# Altium schematic sheet BTTC测试控制板.SchDoc
size A3
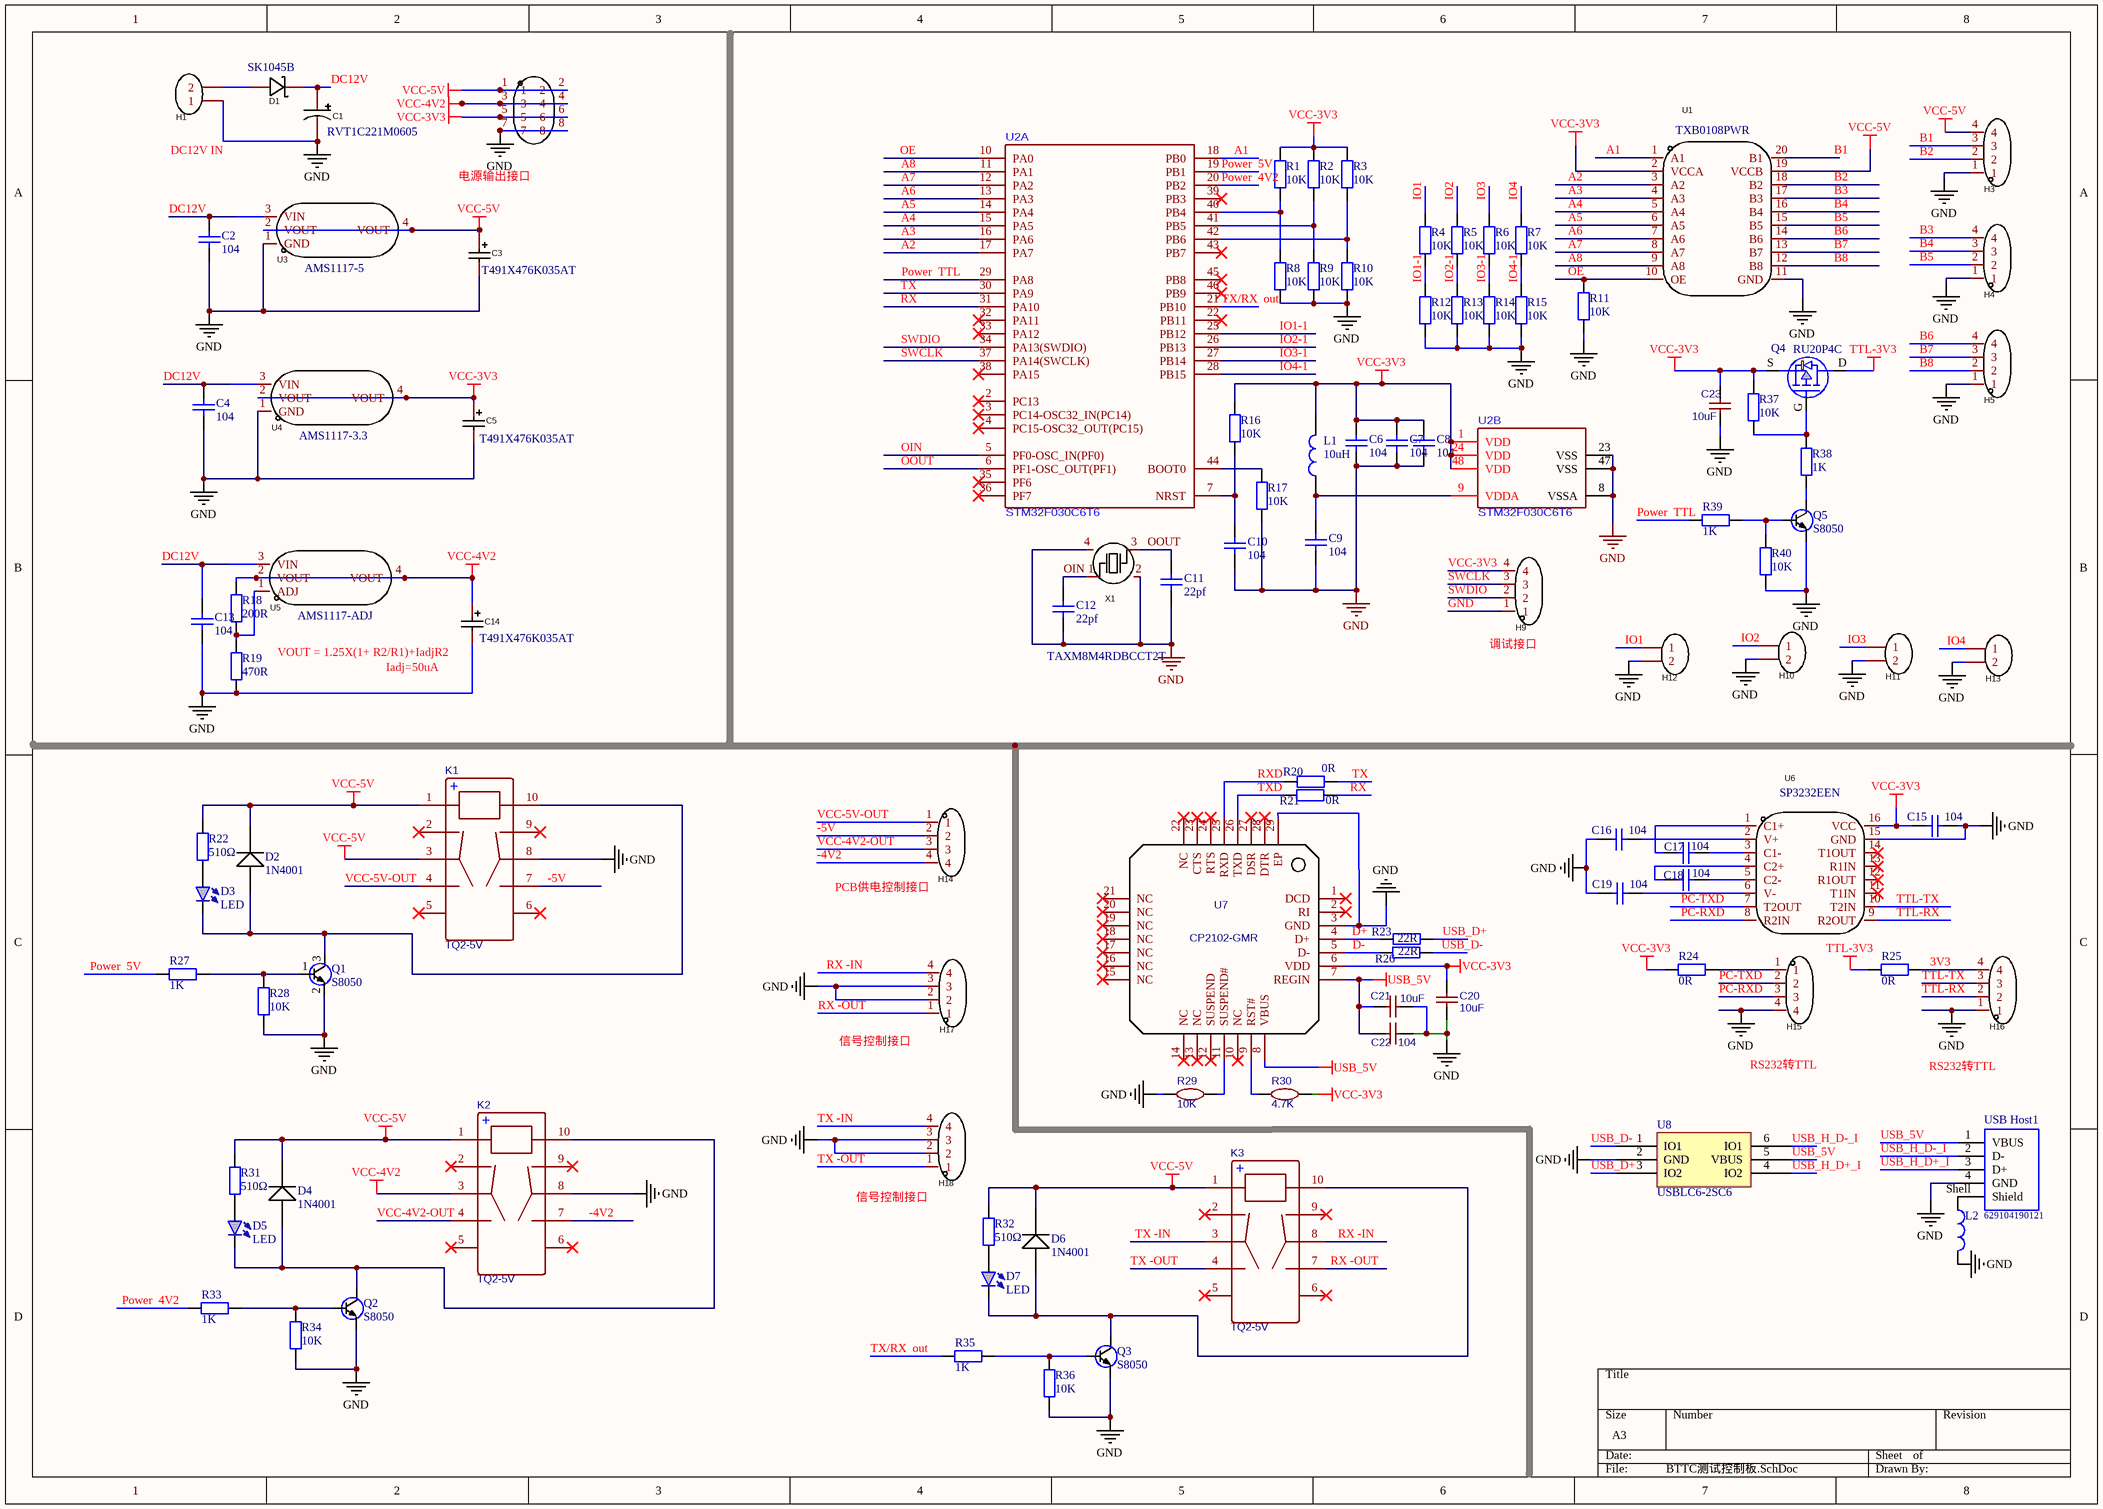
[diagram p0: BTTC测试控制板.SchDoc]

## Parts
C1  RVT1C221M0605  [CAP-SMD_BD10.0-L10.3-W10.3-LS11.0-FD]
C2  104  [C0603]
C3  T491X476K035AT  [CAP-SMD_L3.5-W2.8-R-RD]
C4  104  [C0603]
C5  T491X476K035AT  [CAP-SMD_L3.5-W2.8-R-RD]
C6  104  [C0603]
C7  104  [C0603]
C8  104  [C0603]
C9  104  [C0603]
C10  104  [C0603]
C11  22pf  [C0603]
C12  22pf  [C0603]
C13  104  [C0603]
C14  T491X476K035AT  [CAP-SMD_L3.5-W2.8-R-RD]
C15  104  [C0603]
C16  104  [C0603]
C17  104  [C0603]
C18  104  [C0603]
C19  104  [C0603]
C20  10uF  [C0603]
C21  10uF  [C0603]
C22  104  [C0603]
C23  10uF  [C0603]
D1  SK1045B  [SMB_L4.6-W3.6-LS5.3-RD]
D2  1N4001  [SMB_L4.6-W3.6-LS5.3-RD]
D3  LED  [LED_0603]
D4  1N4001  [SMB_L4.6-W3.6-LS5.3-RD]
D5  LED  [LED_0603]
D6  1N4001  [SMB_L4.6-W3.6-LS5.3-RD]
D7  LED  [LED_0603]
H1  2P  [CONN-TH_2P-P2.54]  (value not drawn)
H2  8p-2.54  [P2.54-4X2]  (value not drawn)
H3  4p-2.54  [CONN-TH_4P-P2.54]  (value not drawn)
H4  4p-2.54  [CONN-TH_4P-P2.54]  (value not drawn)
H5  4p-2.54  [CONN-TH_4P-P2.54]  (value not drawn)
H9  4p-2.54  [CONN-TH_4P-P2.54]  (value not drawn)
H10  2P  [CONN-TH_2P-P2.54]  (value not drawn)
H11  2P  [CONN-TH_2P-P2.54]  (value not drawn)
H12  2P  [CONN-TH_2P-P2.54]  (value not drawn)
H13  2P  [CONN-TH_2P-P2.54]  (value not drawn)
H14  4p-2.54  [CONN-TH_4P-P2.54]  (value not drawn)
H15  4p-2.54  [CONN-TH_4P-P2.54]  (value not drawn)
H16  4p-2.54  [CONN-TH_4P-P2.54]  (value not drawn)
H17  4p-2.54  [CONN-TH_4P-P2.54]  (value not drawn)
H18  4p-2.54  [CONN-TH_4P-P2.54]  (value not drawn)
K1  TQ2-5V  [RELAY-TH_TQ2-XXV]
K2  TQ2-5V  [RELAY-TH_TQ2-XXV]
K3  TQ2-5V  [RELAY-TH_TQ2-XXV]
L1  10uH  [L0603]
L2  PZ1608D121-2R0TF  [L0603]  (value not drawn)
Q1  S8050  [SOT23-3]
Q2  S8050  [SOT23-3]
Q3  S8050  [SOT23-3]
Q4  RU20P4C  [SOT23-M]
Q5  S8050  [SOT23-3]
R1  10K  [R0603]
R2  10K  [R0603]
R3  10K  [R0603]
R4  10K  [R0603]
R5  10K  [R0603]
R6  10K  [R0603]
R7  10K  [R0603]
R8  10K  [R0603]
R9  10K  [R0603]
R10  10K  [R0603]
R11  10K  [R0603]
R12  10K  [R0603]
R13  10K  [R0603]
R14  10K  [R0603]
R15  10K  [R0603]
R16  10K  [R0603]
R17  10K  [R0603]
R18  200R  [R0603]
R19  470R  [R0603]
R20  0R  [R0603]
R21  0R  [R0603]
R22  510Ω  [R0603]
R23  22R  [R0603]
R24  0R  [R0603]
R25  0R  [R0603]
R26  22R  [R0603]
R27  1K  [R0603]
R28  10K  [R0603]
R29  10K  [R0603]
R30  4.7K  [R0603]
R31  510Ω  [R0603]
R32  510Ω  [R0603]
R33  1K  [R0603]
R34  10K  [R0603]
R35  1K  [R0603]
R36  10K  [R0603]
R37  10K  [R0603]
R38  1K  [R0603]
R39  1K  [R0603]
R40  10K  [R0603]
U1  TXB0108PWR  [TSSOP-20]
U2  STM32F030C6T6  [LQFP-48_7x7x05P]  (parts A,B of 2)
U3  AMS1117-5  [SOT-223]
U4  AMS1117-3.3  [SOT-223]
U5  AMS1117-ADJ  [SOT-223]
U6  SP3232EEN  [SOP-16_L10.0-W3.9-P1.27-LS6.0-BL]
U7  CP2102-GMR  [WQFN-28_L5.0-W5.0-P0.50-BL-EP3.2]
U8  USBLC6-2SC6  [SOT-23-6_L2.9-W1.6-P0.95-LS2.8-BR]
USB_Host1  629104190121  [USB-A]
X1  TAXM8M4RDBCCT2T  [OSC-SMD_4P-L3.2-W2.5-BL]

## Nets
GND: C1.2 C2.2 C3.2 C4.2 C5.2 C6.2 C7.1 C8.2 C9.2 C10.2 C11.2 C12.2 C13.2 C14.2 C15.2 C16.1 C19.1 C20.1 C21.2 C22.2 C23.1 H1.1 H2.7 H2.8 H3.1 H4.1 H5.1 H9.1 H10.2 H11.2 H12.2 H13.2 H15.4 H16.1 H17.2 H17.3 H18.2 H18.3 K1.8 K2.8 L2.2 Q1.2 Q2.2 Q3.2 Q5.2 R8.2 R9.2 R10.2 R11.2 R12.2 R13.2 R14.2 R15.2 R17.2 R19.2 R28.1 R29.1 R34.1 R36.1 R40.1 U1.11(GND) U2.8(VSSA) U2.23(VSS) U2.47(VSS) U3.1(GND) U4.1(GND) U6.15(GND) U7.3(GND) U7.29(EP) U8.2(GND) USB_Host1.4(GND) X1.2 X1.4
TTL-3V3: Q4.D(DRAIN) R25.2
USB_5V: C21.1 C22.1 U7.7(REGIN) U7.8(VBUS) U8.5(VBUS) USB_Host1.1(VBUS)
VCC-3V3: C5.1 C6.1 C7.2 C8.1 C15.1 C20.2 C23.2 H2.5 H2.6 H9.4 L1.2 Q4.S(SOURCE) R1.1 R2.1 R3.1 R16.1 R24.2 R30.1 R37.1 U1.2(VCCA) U2.1(VDD) U2.24(VDD) U2.48(VDD) U4.2(VOUT) U4.4(VOUT) U6.16(VCC) U7.6(VDD)
VCC-4V2: C14.1 H2.3 H2.4 K2.3 R18.1 U5.2(VOUT) U5.4(VOUT)
VCC-5V: C3.1 D2.1 D4.1 D6.1 H2.1 H2.2 H3.4 K1.1 K1.3 K2.1 K3.1 R22.2 R31.2 R32.2 U1.19(VCCB) U3.2(VOUT) U3.4(VOUT)
3V3: H16.4 R25.1
-4V2: H14.4 K2.7
-5V: H14.2 K1.7
A1: U1.1(A1) U2.18(PB0)
A2: U1.3(A2) U2.17(PA7)
A3: U1.4(A3) U2.16(PA6)
A4: U1.5(A4) U2.15(PA5)
A5: U1.6(A5) U2.14(PA4)
A6: U1.7(A6) U2.13(PA3)
A7: U1.8(A7) U2.12(PA2)
A8: U1.9(A8) U2.11(PA1)
B1: H3.3 U1.20(B1)
B2: H3.2 U1.18(B2)
B3: H4.4 U1.17(B3)
B4: H4.3 U1.16(B4)
B5: H4.2 U1.15(B5)
B6: H5.4 U1.14(B6)
B7: H5.3 U1.13(B7)
B8: H5.2 U1.12(B8)
D+: R23.2 U7.4(D+)
D-: R26.2 U7.5(D-)
DC12V: C1.1 C2.1 C4.1 C13.1 D1.1(K) U3.3(VIN) U4.3(VIN) U5.3(VIN)
IO1: H12.1 R4.1
IO1-1: R4.2 R12.1 U2.25(PB12)
IO2: H10.1 R5.1
IO2-1: R5.2 R13.1 U2.26(PB13)
IO3: H11.1 R6.1
IO3-1: R6.2 R14.1 U2.27(PB14)
IO4: H13.1 R7.1
IO4-1: R7.2 R15.1 U2.28(PB15)
OE: R11.1 U1.10(OE) U2.10(PA0)
OIN: C12.1 U2.5(PF0-OSC_IN(PF0)) X1.1
OOUT: C11.1 U2.6(PF1-OSC_OUT(PF1)) X1.3
PC-RXD: H15.3 U6.8(R2IN)
PC-TXD: H15.2 U6.7(T2OUT)
Power  4V2: R33.2 U2.20(PB2)
Power  5V: R27.2 U2.19(PB1)
Power  TTL: R39.2 U2.29(PA8)
RX: R21.1 U2.31(PA10)
RX -IN: H17.4 K3.8
RX -OUT: H17.1 K3.7
RXD: R20.2 U7.25(RXD)
SWCLK: H9.3 U2.37(PA14(SWCLK))
SWDIO: H9.2 U2.34(PA13(SWDIO))
TTL-RX: H16.2 U6.9(R2OUT)
TTL-TX: H16.3 U6.10(T2IN)
TX: R20.1 U2.30(PA9)
TX -IN: H18.4 K3.3
TX -OUT: H18.1 K3.4
TX/RX  out: R35.2 U2.21(PB10)
TXD: R21.2 U7.26(TXD)
USB_D+: R23.1 U8.3(IO2)
USB_D-: R26.1 U8.1(IO1)
USB_H_D+_I: U8.4(IO2) USB_Host1.3(D+)
USB_H_D-_I: U8.6(IO1) USB_Host1.2(D-)
VCC-4V2-OUT: H14.3 K2.4
VCC-5V-OUT: H14.1 K1.4
NetC9_1: C9.1 L1.1 U2.9(VDDA)
NetC10_1: C10.1 R16.2 U2.7(NRST)
NetC16_2: C16.2 U6.2(V+)
NetC17_1: C17.1 U6.3(C1-)
NetC17_2: C17.2 U6.1(C1+)
NetC18_1: C18.1 U6.4(C2+)
NetC18_2: C18.2 U6.5(C2-)
NetC19_2: C19.2 U6.6(V-)
NetD1_2: D1.2(A) H1.2
NetD2_2: D2.2 D3.2 K1.10 Q1.3
NetD3_1: D3.1 R22.1
NetD4_2: D4.2 D5.2 K2.10 Q2.3
NetD5_1: D5.1 R31.1
NetD6_2: D6.2 D7.2 K3.10 Q3.3
NetD7_1: D7.1 R32.1
NetH15_1: H15.1 R24.1
NetL2_1: L2.1 USB_Host1.Shell(Shield)
NetQ1_1: Q1.1 R27.1 R28.2
NetQ2_1: Q2.1 R33.1 R34.2
NetQ3_1: Q3.1 R35.1 R36.2
NetQ4_G: Q4.G(GATE) R37.2 R38.1
NetQ5_1: Q5.1 R39.1 R40.2
NetQ5_3: Q5.3 R38.2
NetR1_2: R1.2 R8.1 U2.40(PB4)
NetR2_2: R2.2 R9.1 U2.41(PB5)
NetR3_2: R3.2 R10.1 U2.42(PB6)
NetR17_1: R17.1 U2.44(BOOT0)
NetR18_2: R18.2 R19.1 U5.1(ADJ)
NetR29_2: R29.2 U7.11(SUSPEND#)
NetR30_2: R30.2 U7.9(RST#)

Not connected (* = marked no-connect by the designer): K1 2* 5* 6* 9*; K2 2* 5* 6* 9*; K3 2* 5* 6* 9*; U2 2(PC13)* 3(PC14-OSC32_IN(PC14))* 4(PC15-OSC32_OUT(PC15))* 22(PB11)* 32(PA11)* 33(PA12)* 35(PF6)* 36(PF7)* 38(PA15)* 39(PB3)* 43(PB7)* 45(PB8)* 46(PB9)*; U6 11(T1IN)* 12(R1OUT)* 13(R1IN)* 14(T1OUT)*; U7 1(DCD)* 2(RI)* 10(NC)* 12(SUSPEND)* 13(NC)* 14(NC)* 15(NC)* 16(NC)* 17(NC)* 18(NC)* 19(NC)* 20(NC)* 21(NC)* 22(NC)* 23(CTS)* 24(RTS)* 27(DSR)* 28(DTR)*

## Notes on the sheet
- (near H1) DC12V IN
- 电源输出接口
- (near H9) 调试接口
- VOUT = 1.25X(1+ R2/R1)+IadjR2
- Iadj=50uA
- (near H14) PCB供电控制接口
- 信号控制接口
- RS232转TTL
- (near H18) 信号控制接口
- (in symbol TQ2-5V) +

## Library data of the parts
C1 = RVT1C221M0605: Manufacturer: ROQANG(容强); Name: 220uF; Add into BOM: yes; Value: 220uF; Tolerance: ±20%; Rated Voltage: 16V; φD: 6.3mm; L: 5.4mm; Lifetime @ Temp: 2000hrs@105℃; Symbol: RVT1C221M0605; Device: RVT1C221M0605; LCSC Part Name: 220uF ±20% 16V; Supplier Part: C2977551; Manufacturer Part: RVT1C221M0605; Supplier Footprint: SMD,6.3x5.4mm; JLCPCB Part Class: Extended Part; Datasheet: https://atta.szlcsc.com/upload/public/pdf/source/20220223/DD822675CC1DF2F0C06D5C2255C9C2D9.pdf; Supplier: LCSC; Convert to PCB: yes; Operating Temperature: -55℃~+105℃
C2 C4 C6-C13 C15-C19 = CAP: vaule: 100nF
C3 C5 C14 = T491X476K035AT: Name: 47uF; Add into BOM: yes; Value: 47uF; Rated Voltage: 35V; Symbol: T491X476K035AT; Device: T491X476K035AT; Supplier Part: C87110; Manufacturer Part: T491X476K035AT; Supplier Footprint: CASE-X_7343; JLCPCB Part Class: Extended Part; Datasheet: https://atta.szlcsc.com/upload/public/pdf/source/20170712/C87110_1499827775939813462.pdf; Supplier: LCSC; Convert to PCB: yes
C20 C21 C23 = 10uF: BOM_Manufacturer: FH; BOM_Manufacturer Part: 0603X106K100NT; nameAlias: Capacitance; BOM_Supplier: LCSC; BOM_Supplier Part: C38898; spicePre: C; spiceSymbolName: 0603X106K100NT
C22 = 100nF: BOM_Manufacturer: FH; BOM_Manufacturer Part: 0603B104K500NT; nameAlias: Capacitance; BOM_Supplier: LCSC; BOM_Supplier Part: C30926; BOM_JLCPCB Part Class: Extended Part; spicePre: C; spiceSymbolName: 0603B104K500NT
D1 = SK1045B: Manufacturer: MDD; Symbol: SK1045_C65017; Add into BOM: yes; Reverse Voltage (Vr): 45V; Average Rectified Current (Io): 10A; Forward Voltage (Vf@If): 650mV@10A; Name: SK1045B; Device: SK1045B; LCSC Part Name: 45V 10A 650mV@10A; Supplier Part: C65017; Manufacturer Part: SK1045B; Supplier Footprint: SMB(DO-214AA); JLCPCB Part Class: Extended Part; Datasheet: https://atta.szlcsc.com/upload/public/pdf/source/20210114/C65017_CFDBB1A44C413BA0717A37D04B102673.pdf; Supplier: LCSC; Convert to PCB: yes
D2 D4 D6 = D
D3 D5 D7 = LED: 贴片电阻; ComponentLink1Description: 供应商链接; ComponentLink1URL: http://www.szlcsc.com/product/details_21904.html; Package: 0603; Supplier: LC; SuppliersPartNumber: C21190
H1 H10-H13 = 2P: Manufacturer: TE Connectivity(美国泰科); Name: 826629-2; Symbol: Header-Male-2.54_1x2; Add into BOM: yes; Pitch: 2.54mm; Pin Structure: 1x2P; Device: 826629-2; LCSC Part Name: 2.54mm 1x2P 直插; Supplier Part: C86471; Manufacturer Part: 826629-2; Supplier Footprint: 插件,P=2.54mm; JLCPCB Part Class: Extended Part; Datasheet: https://atta.szlcsc.com/upload/public/pdf/source/20161105/1478330325829.pdf; Supplier: LCSC; Convert to PCB: yes; Number of Rows: 单排; Number of Pins: 2; Row Spacing: -; Mounting Type: 直插; Circluar Pins/Square Pins: -; Current Rating (Max): -; Voltage Rating (Max): -; Length of Mating Pin: -; Insulation Height: 2.8mm; Contact Material: 黄铜; Contact Plating: -; Color: 绿色
H2 = 8p-2.54: Manufacturer: TE Connectivity(美国泰科); Name: 826629-4; Add into BOM: yes; Pitch: 2.54mm; Pin Structure: 1x4P; Symbol: 826629-4; Device: 826629-4; LCSC Part Name: 2.54mm 1x4P 直插; Supplier Part: C590277; Manufacturer Part: 826629-4; Supplier Footprint: 插件,P=2.54mm; JLCPCB Part Class: Extended Part; Datasheet: https://atta.szlcsc.com/upload/public/pdf/source/20210923/FCC8CD9A04BA2624CF68C067B4A5B53A.pdf; Supplier: LCSC; Convert to PCB: yes; Number of Rows: 单排; Number of Pins: 4; Row Spacing: -; Mounting Type: 直插; Circluar Pins/Square Pins: -; Current Rating (Max): -; Voltage Rating (Max): -; Length of Mating Pin: 6.7mm; Insulation Height: 2.8mm; Length of End Connection Pin: 3.2mm; Contact Material: -; Operating Temperature Range: -; Color: 绿色
H3-H5 H9 H14-H18 = 4p-2.54: Manufacturer: TE Connectivity(美国泰科); Name: 826629-4; Add into BOM: yes; Pitch: 2.54mm; Pin Structure: 1x4P; Symbol: 826629-4; Device: 826629-4; LCSC Part Name: 2.54mm 1x4P 直插; Supplier Part: C590277; Manufacturer Part: 826629-4; Supplier Footprint: 插件,P=2.54mm; JLCPCB Part Class: Extended Part; Datasheet: https://atta.szlcsc.com/upload/public/pdf/source/20210923/FCC8CD9A04BA2624CF68C067B4A5B53A.pdf; Supplier: LCSC; Convert to PCB: yes; Number of Rows: 单排; Number of Pins: 4; Row Spacing: -; Mounting Type: 直插; Circluar Pins/Square Pins: -; Current Rating (Max): -; Voltage Rating (Max): -; Length of Mating Pin: 6.7mm; Insulation Height: 2.8mm; Length of End Connection Pin: 3.2mm; Contact Material: -; Operating Temperature Range: -; Color: 绿色
K1-K3 = TQ2-5V: BOM_Manufacturer: PANASONIC; BOM_Supplier: LCSC; BOM_Manufacturer Part: TQ2-5V; image: //image.lceda.cn/szlcsc/C46047.jpg; BOM_Supplier Part: C46047; spicePre: K; spiceSymbolName: TQ2-5V
L1 = L: value: 10uH
L2 = CMP-006-00022-2
Q4 = P-MOS
R1-R17 R37 = Res: Resistor; Published: 8-Jun-2000; LatestRevisionDate: 17-Jul-2002; LatestRevisionNote: Re-released for DXP Platform.; PackageReference: AXIAL-0.4; Publisher: Altium Limited; Value: 10K
R18 R19 R38 = Res: Resistor; Value: 10K; Published: 8-Jun-2000; LatestRevisionDate: 17-Jul-2002; LatestRevisionNote: Re-released for DXP Platform.; PackageReference: AXIAL-0.4; Publisher: Altium Limited
R20 R21 R23 R26 R28 R34 R36 R40 = 0603 10KΩ (1002) 1%: 贴片电阻; ComponentLink1Description: 供应商链接; ComponentLink1URL: http://www.szlcsc.com/product/details_26547.html; Package: 0603; Supplier: LC; SuppliersPartNumber: C25804
R22 R31 R32 = 0603 510Ω (5100) 1%: 贴片电阻; ComponentLink1Description: 供应商链接; ComponentLink1URL: http://www.szlcsc.com/product/details_23920.html; Package: 0603; Supplier: LC; SuppliersPartNumber: C23193
R24 R25 R27 R33 R35 R39 = 0603 1KΩ (1001) 1%: 贴片电阻; ComponentLink1Description: 供应商链接; ComponentLink1URL: http://www.szlcsc.com/product/details_21904.html; Package: 0603; Supplier: LC; SuppliersPartNumber: C21190
R29 = 10K: BOM_Manufacturer: UniOhm; BOM_Manufacturer Part: 0603WAF1002T5E; nameAlias: Resistance (Ohms); BOM_Supplier: LCSC; BOM_Supplier Part: C25804; BOM_JLCPCB Part Class: Basic Part; spicePre: R; spiceSymbolName: 0603WAF1002T5E
R30 = 4.7K: BOM_Manufacturer: UniOhm; BOM_Manufacturer Part: 0603WAJ0472T5E; nameAlias: Resistance (Ohms); BOM_Supplier: LCSC; BOM_Supplier Part: C25999; BOM_JLCPCB Part Class: Extended Part; spicePre: R; spiceSymbolName: 0603WAJ0472T5E
U1 = TXB0108PWR: Add into BOM: yes; Number of Channels: 8; Supply Voltage (VCCA): 1.2V~3.6V; Supply Voltage (VCCB): 1.65V~5.5V; Data Rate: 100Mbps; Name: TXB0108PWR; Symbol: TXB0108PWR; Device: TXB0108PWR; LCSC Part Name: TXB0108PWR; Supplier Part: C53406; Manufacturer Part: TXB0108PWR; Supplier Footprint: TSSOP-20; JLCPCB Part Class: Extended Part; Datasheet: https://atta.szlcsc.com/upload/public/pdf/source/20150713/1457707329879.pdf; Supplier: LCSC; Convert to PCB: yes; Input Signal: -; Output Signal: -
U3-U5 = AIP1117-5GH.TR: Manufacturer: I-CORE(中微爱芯); Add into BOM: yes; Name: AIP1117-5GH.TR; Symbol: AIP1117-5GH.TR; Device: AIP1117-5GH.TR; LCSC Part Name: AIP1117-5GH.TR; Supplier Part: C2974590; Manufacturer Part: AIP1117-5GH.TR; Supplier Footprint: SOT-223; JLCPCB Part Class: Extended Part; Datasheet: https://atta.szlcsc.com/upload/public/pdf/source/20220119/4E565B04C99A768A2C282E8EEF17C981.pdf; Supplier: LCSC; Convert to PCB: yes
U6 = SP3232EEN: Add into BOM: yes; Name: SP3232EEN; Symbol: SP3232EEN; Device: SP3232EEN; LCSC Part Name: SP3232EEN; Supplier Part: C2904739; Manufacturer Part: SP3232EEN; Supplier Footprint: SOP-16; JLCPCB Part Class: Extended Part; Datasheet: https://atta.szlcsc.com/upload/public/pdf/source/20220325/1C86CD1993E1AE710CB3AF87E322F9BE.pdf; Supplier: LCSC; Convert to PCB: yes
U7 = CP2102-GMR: BOM_Manufacturer: SILICON LABS; BOM_Supplier: LCSC; BOM_Manufacturer Part: CP2102-GMR; BOM_Supplier Part: C6568; BOM_JLCPCB Part Class: Basic Part; spicePre: U; spiceSymbolName: CP2102-GMR
U8 = CMP-004-00033-2: TVS DIODE 5.25V 17V SOT23-6; Working Voltage: 5V; Reverse Breakdown Voltage: 6V; Number of Bidirectional Channels: 2; Peak Pulse Current: 5A; ESD Protection: Yes; Test Current: 1mA; Element Configuration: Dual; Max Reverse Leakage Current: 150nA; Operating Supply Voltage: 1.1V; Polarity: Unidirectional,Bidirectional; Data Rate: 480Mbps; Number of Elements: 1; Capacitance: 3.5pF; Min Operating Temperature: -40°C; Mount: Surface Mount; Case/Package: SOT-23; REACH SVHC: No SVHC; Contact Plating: Tin,Matte; Clamping Voltage: 17V; Package Quantity: 3000; Number of Pins: 6; Lead Free: Lead Free; Height: 1.3mm; Reverse Standoff Voltage: 5.25V; Packaging: Tape and Reel; Termination: SMD/SMT; Direction: Unidirectional,Bidirectional; Leakage Current: 150nA; Radiation Hardening: No; Breakdown Voltage: 6V; Min Breakdown Voltage: 6V; Power Line Protection: Yes; Max Breakdown Voltage: 6V; Max Operating Temperature: 125°C; Width: 1.75mm; Length: 3.05mm; Depth: 1.75mm; Number of Channels: 2
USB_Host1 = CMP-007-0023-1: USB 2.0 Type A, Receptacle, Horizontal - Short Type, SMT; Manufacturer: Wurth Elektronik; Working Voltage: 30VAC; Interface Type: Type A; Rated Current: 1.5A; Pin Number: 4; Component Type: Standard; Design Item ID: 629104190121; Mounting Technology: SMT; Manufacturer Part Number: 629104190121; Published Date: August 2020; ComponentLink1Description: Manufacturer; Gender: Receptacle; ComponentLink2Description: Datasheet; ComponentLink1URL: http://www.we-online.de; Type: Horizontal - Short Type; ComponentLink2URL: https://katalog.we-online.com/em/datasheet/629104190121.pdf; Packaging: Tape and Reel; Application: USB 2.0; Source: WR-USB_USB 2.0.SchLib; Operating Temperature: -40 to +85degC; Pin Count: 5
X1 = TAXM8M4RDBCCT2T: Manufacturer: TAE(雅晶鑫); Name: 8MHz; Add into BOM: yes; Crystal Type: 贴片无源晶振; Value: 8MHz; Frequency Tolerance: ±10ppm; Frequency Stability: ±15ppm; Load Capacitance: 10pF; Equivalent Series Resistance (ESR): 250Ω; Symbol: TAXM8M4RDBCCT2T; Device: TAXM8M4RDBCCT2T; LCSC Part Name: 8MHz ±10ppm 10pF; Supplier Part: C400090; Manufacturer Part: TAXM8M4RDBCCT2T; Supplier Footprint: SMD3225-4P; JLCPCB Part Class: Extended Part; Datasheet: https://atta.szlcsc.com/upload/public/pdf/source/20190626/C400090_CF95B89E745AFE4EF2E392EF8AC009D6.pdf; Supplier: LCSC; Convert to PCB: yes; Operating Temperature: -